# EAGLE design ALGO_dsPIC (EAGLE 4.16)
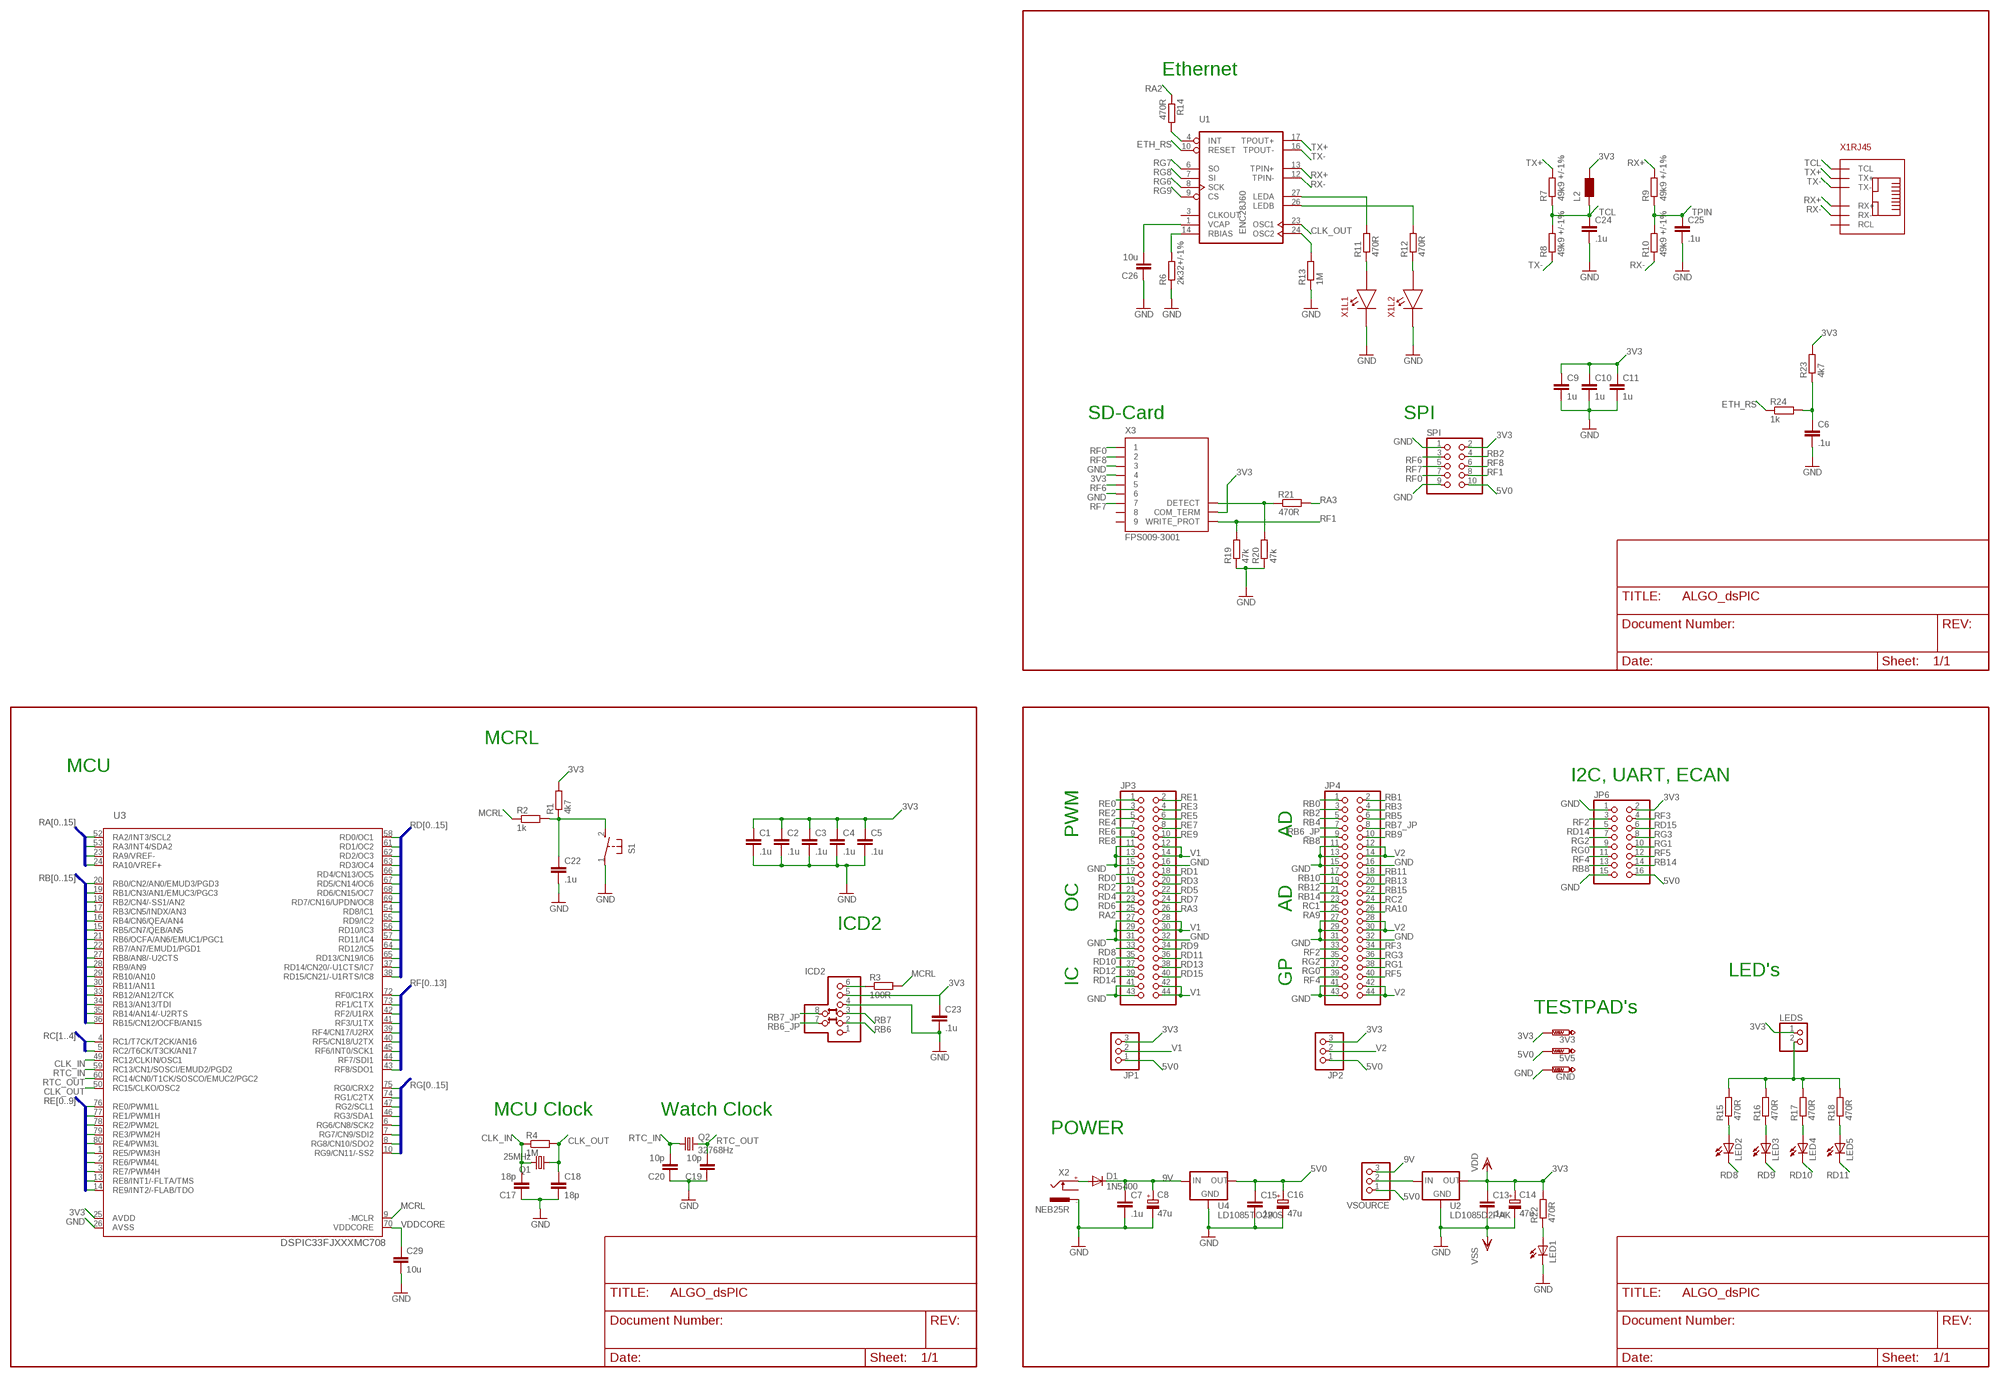
[diagram p0: schematic, sheet 1]

## Parts
3V3  PTR1PAD1-17  [P1-17]
5V5  PTR1PAD1-17  [P1-17]
C1  .1u  C-EUC0805  [C0805]
C2  .1u  C-EUC0805  [C0805]
C3  .1u  C-EUC0805  [C0805]
C4  .1u  C-EUC0805  [C0805]
C5  .1u  C-EUC0805  [C0805]
C6  .1u  C-EUC0805  [C0805]
C7  .1u  C-EUC0805  [C0805]
C8  47u  CPOL-EUE  [PANASONIC_E]
C9  1u  C-EUC0805  [C0805]
C10  1u  C-EUC0805  [C0805]
C11  1u  C-EUC0805  [C0805]
C13  .1u  C-EUC0805  [C0805]
C14  47u  CPOL-EUE  [PANASONIC_E]
C15  .1u  C-EUC0805  [C0805]
C16  47u  CPOL-EUE  [PANASONIC_E]
C17  18p  C-EUC0805  [C0805]
C18  18p  C-EUC0805  [C0805]
C19  10p  C-EUC0805  [C0805]
C20  10p  C-EUC0805  [C0805]
C22  .1u  C-EUC0805  [C0805]
C23  .1u  C-EUC0805  [C0805]
C24  .1u  C-EUC0805  [C0805]
C25  .1u  C-EUC0805  [C0805]
C26  10u  C-EUC0805  [C0805]
C29  10u  C-EUC0805  [C0805]
D1  1N5400  [DO201-15]
GND  PTR1PAD1-17  [P1-17]
ICD2  ICD2  [ICD2_JP]
JP1  PINHD-1X3  [1X03]
JP2  PINHD-1X3  [1X03]
JP3  PINHD-2X22  [2X22]
JP4  PINHD-2X22  [2X22]
JP6  PINHD-2X8  [2X08]
L2  WE-CBF_1210  [1210]
LED1  LEDSMT1206  [1206]
LED2  LEDSMT1206  [1206]
LED3  LEDSMT1206  [1206]
LED4  LEDSMT1206  [1206]
LED5  LEDSMT1206  [1206]
LEDS  PINHD-1X2  [1X02]
Q1  25MHz  CRYSTALHC49UP  [HC49UP]
Q2  32768Hz  CRYSTALTC26V  [TC26V]
R1  4k7  R-EU_M0805  [M0805]
R2  1k  R-EU_M0805  [M0805]
R3  100R  R-EU_M0805  [M0805]
R4  1M  R-EU_M0805  [M0805]
R6  2k32+/-1%  R-EU_M1206  [M1206]
R7  49k9 +/-1%  R-EU_M0805  [M0805]
R8  49k9 +/-1%  R-EU_M0805  [M0805]
R9  49k9 +/-1%  R-EU_M0805  [M0805]
R10  49k9 +/-1%  R-EU_M0805  [M0805]
R11  470R  R-EU_M0805  [M0805]
R12  470R  R-EU_M0805  [M0805]
R13  1M  R-EU_M0805  [M0805]
R14  470R  R-EU_M0805  [M0805]
R15  470R  R-EU_M0805  [M0805]
R16  470R  R-EU_M0805  [M0805]
R17  470R  R-EU_M0805  [M0805]
R18  470R  R-EU_M0805  [M0805]
R19  47k  R-EU_M0805  [M0805]
R20  47k  R-EU_M0805  [M0805]
R21  470R  R-EU_M0805  [M0805]
R22  470R  R-EU_M0805  [M0805]
R23  4k7  R-EU_M0805  [M0805]
R24  1k  R-EU_M0805  [M0805]
S1  31-XX  [B3F-31XX]
SPI  PINHD-2X5  [2X05]
U1  ENC28J60  [SSOP28]
U2  LD1085D2PAK  [D2PAK]
U3  DSPIC33FJXXXMC708  [TQFP80-12X12]
U4  LD1085TO220S  [TO220S]
VSOURCE  PINHD-1X3  [1X03]
X1  AMPHENOL_RJ45JACK  [AMPHENOL_RJ45]
X2  NEB25R  [NEB25R]
X3  FPS009-3001  [FPS009-3000]

## Nets
3V3 [3v3]: 3V3.1(TP) C1.1 C2.1 C3.1 C4.1 C5.1 C9.1 C10.1 C11.1 C13.1 C14.+ C23.1 ICD2.5 JP1.3 JP2.3 JP6.2 L2.2 LEDS.1 R1.2 R22.2 R23.2 SPI.2 U2.2(OUT) U3.25(AVDD) X3.4 X3.COM_TERM ; supply symbol labelled VDD
5V0 [pwr]: 5V5.1(TP) C15.1 C16.+ JP1.1 JP2.1 JP6.16 SPI.10 U4.2(OUT) VSOURCE.1
9V [pwr]: C7.1 C8.+ D1.C U4.3(IN) VSOURCE.3
CLK_IN [clk]: C17.2 Q1.2 R4.1 U3.49(RC12/CLKIN/OSC1)
CLK_OUT [clk]: C18.1 Q1.1 R4.2 U1.23(OSC1) U3.50(RC15/CLKO/OSC2)
ETH_RS [d_signal]: R24.1 U1.10(RESET)
GND [pwr]: C1.2 C2.2 C3.2 C4.2 C5.2 C6.2 C7.2 C8.- C9.2 C10.2 C11.2 C13.2 C14.- C15.2 C16.- C17.1 C18.2 C19.1 C20.1 C22.2 C23.2 C24.2 C25.2 C26.1 C29.2 GND.1(TP) ICD2.4 JP3.11 JP3.13 JP3.15 JP3.16 JP3.27 JP3.29 JP3.31 JP3.32 JP3.41 JP3.43 JP4.11 JP4.13 JP4.15 JP4.16 JP4.27 JP4.29 JP4.31 JP4.32 JP4.41 JP4.43 JP6.1 JP6.15 LED1.C R6.1 R13.1 R19.1 R20.1 S1.1(P) SPI.1 SPI.9 U2.1(GND) U3.26(AVSS) U4.1(GND) X1.P$7 X1.P$9 X2.- X3.3 X3.6 ; supply symbol labelled VSS
LEDA [a_signal]: R11.2 U1.27(LEDA)
LEDB [a_signal]: R12.2 U1.26(LEDB)
MCRL [d_signal]: R2.1 R3.2 U3.9(-MCLR)
N$1 [pwr]: U2.3(IN) VSOURCE.2
N$2 [pwr]: D1.A X2.+
N$3: LED2.A R15.1
N$4: LED3.A R16.1
N$5: LED4.A R17.1
N$6: LED1.A R22.1
N$7 [a_signal]: R12.1 X1.P$10
N$9 [d_signal]: C22.1 R1.1 R2.2 S1.2(S)
N$10 [d_signal]: ICD2.6 R3.1
N$11: R14.2 U1.4(INT)
N$12: LED5.A R18.1
N$13 [d_signal]: C6.1 R23.1 R24.2
N$14: R11.1 X1.P$8
N$19 [d_signal]: R20.2 R21.1 X3.DETECT
N$25: LEDS.2 R15.2 R16.2 R17.2 R18.2
OSC2 [clk]: R13.2 U1.24(OSC2)
RA2 [d_signal]: JP3.25 R14.1 U3.52(RA2/INT3/SCL2)
RA3 [d_signal]: JP3.26 R21.2 U3.53(RA3/INT4/SDA2)
RA9 [a_signal]: JP4.25 U3.23(RA9/VREF-)
RA10 [a_signal]: JP4.26 U3.24(RA10/VREF+)
RB0 [a_signal]: JP4.1 U3.20(RB0/CN2/AN0/EMUD3/PGD3)
RB1 [a_signal]: JP4.2 U3.19(RB1/CN3/AN1/EMUC3/PGC3)
RB2 [a_signal]: JP4.3 SPI.4 U3.18(RB2/CN4/-SS1/AN2)
RB3 [a_signal]: JP4.4 U3.17(RB3/CN5/INDX/AN3)
RB4 [a_signal]: JP4.5 U3.16(RB4/CN6/QEA/AN4)
RB5 [a_signal]: JP4.6 U3.15(RB5/CN7/QEB/AN5)
RB6 [a_signal]: ICD2.2 U3.21(RB6/OCFA/AN6/EMUC1/PGC1)
RB6_JP [d_signal]: ICD2.7 JP4.7
RB7 [a_signal]: ICD2.3 U3.22(RB7/AN7/EMUD1/PGD1)
RB7_JP [d_signal]: ICD2.8 JP4.8
RB8 [a_signal]: JP4.9 JP6.13 U3.27(RB8/AN8/-U2CTS)
RB9 [a_signal]: JP4.10 U3.28(RB9/AN9)
RB10 [a_signal]: JP4.17 U3.29(RB10/AN10)
RB11 [a_signal]: JP4.18 U3.30(RB11/AN11)
RB12 [a_signal]: JP4.19 U3.33(RB12/AN12/TCK)
RB13 [a_signal]: JP4.20 U3.34(RB13/AN13/TDI)
RB14 [a_signal]: JP4.21 JP6.14 U3.35(RB14/AN14/-U2RTS)
RB15 [a_signal]: JP4.22 U3.36(RB15/CN12/OCFB/AN15)
RBIAS [a_signal]: R6.2 U1.14(RBIAS)
RC1 [a_signal]: JP4.23 U3.4(RC1/T7CK/T2CK/AN16)
RC2 [a_signal]: JP4.24 U3.5(RC2/T6CK/T3CK/AN17)
RD0 [d_signal]: JP3.17 U3.58(RD0/OC1)
RD1 [d_signal]: JP3.18 U3.61(RD1/OC2)
RD2 [d_signal]: JP3.19 U3.62(RD2/OC3)
RD3 [d_signal]: JP3.20 U3.63(RD3/OC4)
RD4 [d_signal]: JP3.21 U3.66(RD4/CN13/OC5)
RD5 [d_signal]: JP3.22 U3.67(RD5/CN14/OC6)
RD6 [d_signal]: JP3.23 U3.68(RD6/CN15/OC7)
RD7 [d_signal]: JP3.24 U3.69(RD7/CN16/UPDN/OC8)
RD8 [d_signal]: JP3.33 LED2.C U3.54(RD8/IC1)
RD9 [d_signal]: JP3.34 LED3.C U3.55(RD9/IC2)
RD10 [d_signal]: JP3.35 LED4.C U3.56(RD10/IC3)
RD11 [d_signal]: JP3.36 LED5.C U3.57(RD11/IC4)
RD12 [d_signal]: JP3.37 U3.64(RD12/IC5)
RD13 [d_signal]: JP3.38 U3.65(RD13/CN19/IC6)
RD14 [d_signal]: JP3.39 JP6.5 U3.37(RD14/CN20/-U1CTS/IC7)
RD15 [d_signal]: JP3.40 JP6.6 U3.38(RD15/CN21/-U1RTS/IC8)
RE0 [d_signal]: JP3.1 U3.76(RE0/PWM1L)
RE1 [d_signal]: JP3.2 U3.77(RE1/PWM1H)
RE2 [d_signal]: JP3.3 U3.78(RE2/PWM2L)
RE3 [d_signal]: JP3.4 U3.79(RE3/PWM2H)
RE4 [d_signal]: JP3.5 U3.80(RE4/PWM3L)
RE5 [d_signal]: JP3.6 U3.1(RE5/PWM3H)
RE6 [d_signal]: JP3.7 U3.2(RE6/PWM4L)
RE7 [d_signal]: JP3.8 U3.3(RE7/PWM4H)
RE8 [d_signal]: JP3.9 U3.13(RE8/INT1/-FLTA/TMS)
RE9: JP3.10 U3.14(RE9/INT2/-FLAB/TDO)
RF0 [d_signal]: SPI.7 U3.72(RF0/C1RX) X3.1
RF1 [d_signal]: R19.2 SPI.8 U3.73(RF1/C1TX) X3.WRITE_PROT
RF2 [d_signal]: JP4.33 JP6.3 U3.42(RF2/U1RX)
RF3 [d_signal]: JP4.34 JP6.4 U3.41(RF3/U1TX)
RF4 [d_signal]: JP4.39 JP6.11 U3.39(RF4/CN17/U2RX)
RF5 [d_signal]: JP4.40 JP6.12 U3.40(RF5/CN18/U2TX)
RF6 [d_signal]: SPI.3 U3.45(RF6/INT0/SCK1) X3.5
RF7 [d_signal]: SPI.5 U3.44(RF7/SDI1) X3.7
RF8 [d_signal]: SPI.6 U3.43(RF8/SDO1) X3.2
RG0 [d_signal]: JP4.37 JP6.9 U3.75(RG0/CRX2)
RG1 [d_signal]: JP4.38 JP6.10 U3.74(RG1/C2TX)
RG2 [d_signal]: JP4.35 JP6.7 U3.47(RG2/SCL1)
RG3 [d_signal]: JP4.36 JP6.8 U3.46(RG3/SDA1)
RG6 [d_signal]: U1.8(SCK) U3.6(RG6/CN8/SCK2)
RG7 [d_signal]: U1.6(SO) U3.7(RG7/CN9/SDI2)
RG8 [d_signal]: U1.7(SI) U3.8(RG8/CN10/SDO2)
RG9 [d_signal]: U1.9(CS) U3.10(RG9/CN11/-SS2)
RTC_IN [clk]: C20.2 Q2.1 U3.59(RC13/CN1/SOSCI/EMUD2/PGD2)
RTC_OUT [clk]: C19.2 Q2.2 U3.60(RC14/CN0/T1CK/SOSCO/EMUC2/PGC2)
RX+ [a_signal]: R9.2 U1.13(TPIN+) X1.P$4(RJ45:RX+)
RX- [a_signal]: R10.1 U1.12(TPIN-) X1.P$5(RJ45:RX-)
TCL [a_signal]: C24.1 L2.1 R7.1 R8.2 X1.P$1(RJ45:TCL)
TPIN [a_signal]: C25.1 R9.1 R10.2
TX+ [a_signal]: R7.2 U1.17(TPOUT+) X1.P$2(RJ45:TX+)
TX- [a_signal]: R8.1 U1.16(TPOUT-) X1.P$3(RJ45:TX-)
V1 [pwr]: JP1.2 JP3.12 JP3.14 JP3.28 JP3.30 JP3.42 JP3.44
V2 [pwr]: JP2.2 JP4.12 JP4.14 JP4.28 JP4.30 JP4.42 JP4.44
VCAB [a_signal]: C26.2 U1.1(VCAP)
VDDCORE [3v3]: C29.1 U3.70(VDDCORE)
Unconnected: ICD2.1 U1.3(CLKOUT) U1.5(NC) X1.P$6(RJ45:RCL) X2.C X3.8 X3.9

## Buses
RB[0..15]
RA[0..15]
RC[1..4]
RE[0..9]
RD[0..15]
RF[0..13]
RG[0..15]

## Notes on the sheet
- Ethernet
- SD-Card | SPI
- MCRL
- MCU
- I2C, UART, ECAN
- PWM | AD
- OC | AD
- ICD2
- LED's
- IC | GP
- TESTPAD's
- MCU Clock | Watch Clock
- POWER

## Power pins joined to a net without a drawn wire
3V3: U1.15(VDD) U1.19(VDD) U1.20(VDD) U1.25(VDD) U1.28(VDD) U3.12(VDD) U3.32(VDD) U3.48(VDD) U3.71(VDD)
GND: U1.2(VSS) U1.11(VSS) U1.18(VSS) U1.21(VSS) U1.22(VSS) U3.11(VSS) U3.31(VSS) U3.51(VSS) X1.P$11(GND:GND) X1.P$12(GND@1:GND)

## Library data of the parts
3V3 5V5 GND = testpad:PTR1: TEST PIN
C1-C7 C9-C11 C13 C15 C17-C20 C22-C26 C29 = rcl:C-EU: CAPACITOR, European symbol
C8 C14 C16 = rcl:CPOL-EU: POLARIZED CAPACITOR, European symbol
D1 = diode:1N5400: DIODE standard rectifier, 3 A, 50 V (Motorola)
ICD2 = eigene:ICD2
JP1 JP2 VSOURCE = pinhead:PINHD-1X3: PIN HEADER
JP3 JP4 = pinhead:PINHD-2X22: PIN HEADER
JP6 = pinhead:PINHD-2X8: PIN HEADER
L2 = wuerth-elektronik:WE-CBF: SMD EMI Suppression Ferrite Beads - excellent anti-EMI properties - low DCR - impedances till 3000 ohms - rated current up to 6 A
LED1-LED5 = led:LED: LED OSRAM: - CHIPLED LG R971, LG N971, LY N971, LG Q971, LY Q971, LO R971, LY R971 LH N974, LH R974 LS Q976, LO Q976, LY Q976 LO Q996 - Hyper CHIPLED LW Q18S LB Q993, LB Q99A, LB R99A - SideLED LS A670, LO A670, LY A670, LG A670, LP A670 LB A673, LV A673, LT A673, LW A673 LH A674 LY A675 LS A676, LA A676, LO A676, LY A676, LW A676 LS A679, LY A679, LG A679 - Hyper Micro SIDELED® LS Y876, LA Y876, LO Y876, LY Y876 LT Y87S - SmartLED LW L88C, LW L88S LB L89C, LB L89S, LG L890 LS L89K, LO L89K, LY L89K LS L896, LA L896, LO L896, LY L896 - TOPLED LS T670, LO T670, LY T670, LG T670, LP T670 LSG T670, LSP T670, LSY T670, LOP T670, LYG T670 LG T671, LOG T671, LSG T671 LB T673, LV T673, LT T673, LW T673 LH T674 LS T676, LA T676, LO T676, LY T676, LB T676, LH T676, LSB T676, LW T676 LB T67C, LV T67C, LT T67C, LS T67K, LO T67K, LY T67K, LW E67C LS E67B, LA E67B, LO E67B, LY E67B, LB E67C, LV E67C, LT E67C LW T67C LS T679, LY T679, LG T679 LS T770, LO T770, LY T770, LG T770, LP T770 LB T773, LV T773, LT T773, LW T773 LH T774 LS E675, LA E675, LY E675, LS T675 LS T776, LA T776, LO T776, LY T776, LB T776 LHGB T686 LT T68C, LB T68C - Hyper Mini TOPLED® LB M676 - Mini TOPLED Santana® LG M470 LS M47K, LO M47K, LY M47K Source: http://www.osram.convergy.de - LUMILED® LXK2-PW12-R00, LXK2-PW12-S00, LXK2-PW14-U00, LXK2-PW14-V00 LXK2-PM12-R00, LXK2-PM12-S00, LXK2-PM14-U00 LXK2-PE12-Q00, LXK2-PE12-R00, LXK2-PE12-S00, LXK2-PE14-T00, LXK2-PE14-U00 LXK2-PB12-K00, LXK2-PB12-L00, LXK2-PB12-M00, LXK2-PB14-N00, LXK2-PB14-P00, LXK2-PB14-Q00 LXK2-PR12-L00, LXK2-PR12-M00, LXK2-PR14-Q00, LXK2-PR14-R00 LXK2-PD12-Q00, LXK2-PD12-R00, LXK2-PD12-S00 LXK2-PH12-R00, LXK2-PH12-S00 LXK2-PL12-P00, LXK2-PL12-Q00, LXK2-PL12-R00 Source: www.luxeon.com
LEDS = pinhead:PINHD-1X2: PIN HEADER
Q1 Q2 = crystal:CRYSTAL: CRYSTAL
R1-R4 R6-R24 = rcl:R-EU_: RESISTOR, European symbol
S1 = switch-omron:31-XX: OMRON SWITCH
SPI = pinhead:PINHD-2X5: PIN HEADER
U1 = eigene:ENC28J60
U2 U4 = v-reg-mich:LD1085
U3 = dspic33:DSPIC33FJXXXMC708
X1 = eigene:AMPHENOL_RJ45JACK
X2 = con-lumberg:NEB25R: Klinkeneinbaukupplung
X3 = con-yamaichi:FPS009-300*: SD Card and MMC Reader (Manual Insertion) Source: http://www.yamaichi.de/pdf/c_fps009_3000.pdf

## Net classes
0 default: width 0.254 mm
1 d_signal: width 0.254 mm
2 a_signal: width 0.254 mm
3 pwr: width 0.406 mm, clearance 0.305 mm
4 clk: width 0.254 mm, drill 0.203 mm
5 3v3: width 0.254 mm

## Board
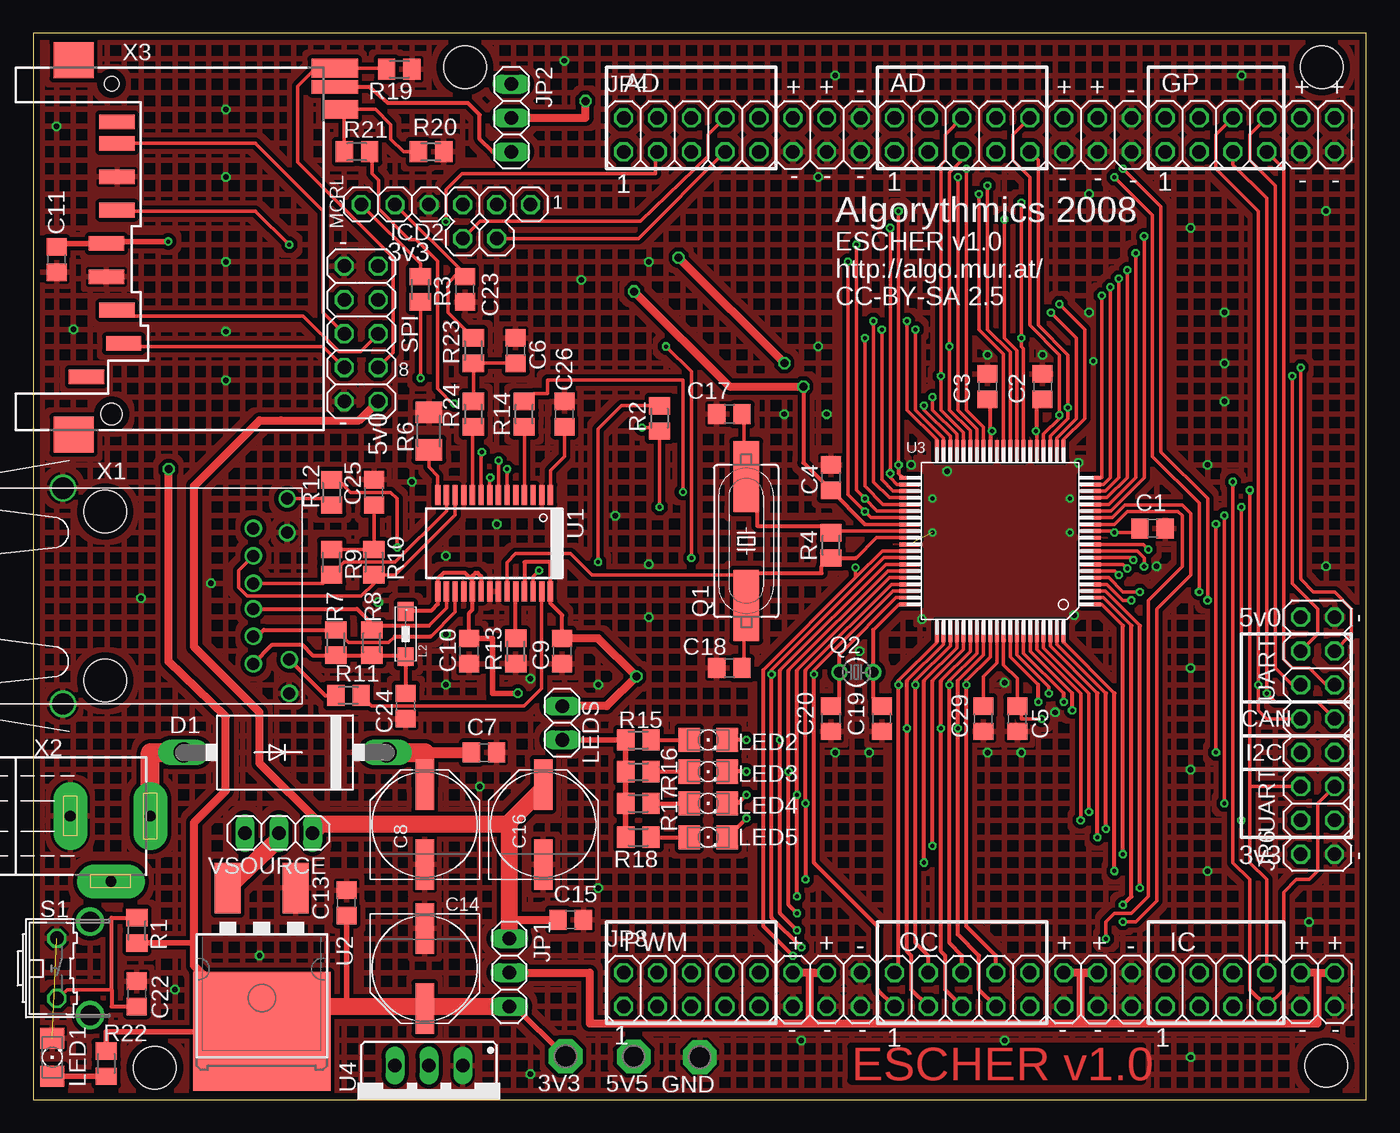
[diagram p1: board, top side]
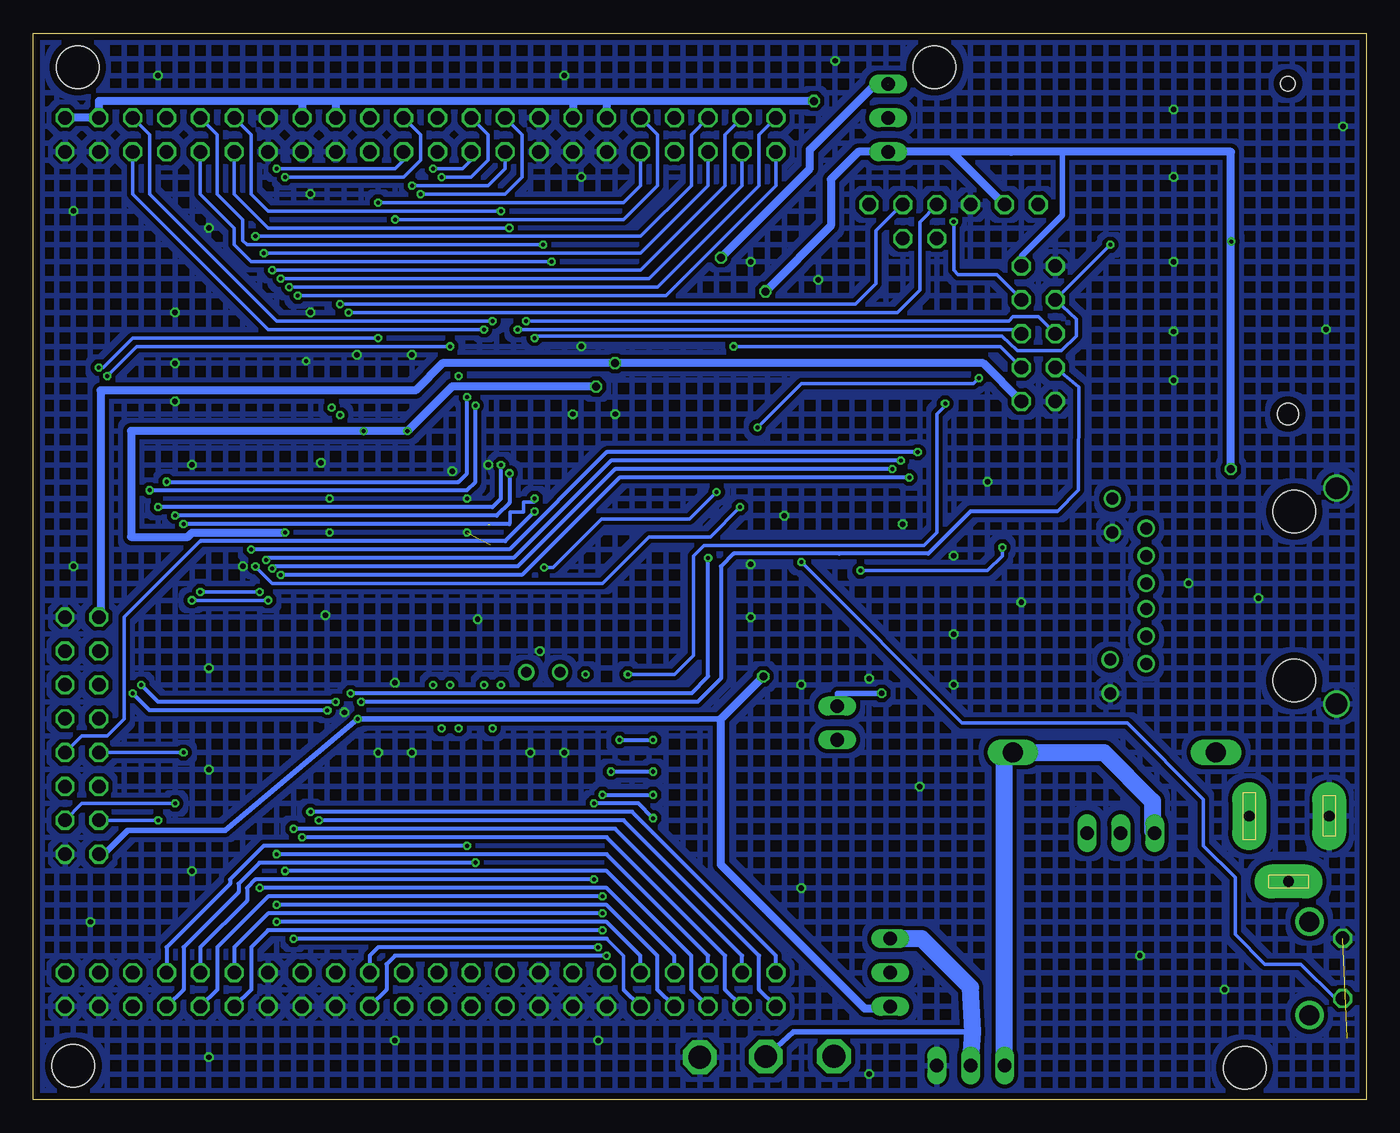
[diagram p2: board, bottom side, seen from below]

Size 100 x 80 mm. Coordinates in mm from the lower left corner, seen from the top.
Outline: 0,0 100,0 100,80 0,80 0,0
Copper layers (1*16): Top 0.035mm / dielectric 1.5mm / Bottom 0.035mm
Design rules "PCB-POOL": minimum track width 6mil, minimum drill 12mil, track to track 6mil, track to pad 6mil, pad to pad 6mil, via to via 6mil, smd to smd 6mil, copper to edge 20mil, drill to drill 8mil, minimum pad ring 8mil, minimum via ring 6mil, stop-mask expansion 3mil, vias tented up to drill 0mil, thermal gap 8mil
Holes 3.2 mm at 96.99,2.54 96.67,77.46 9.12,2.38 32.38,77.46

### Footprints (pad centres in the part's own frame; a part is rotated, then mirrored left to right if it is on the bottom)
P1-17 = drill 1.702 pad 2.54 octagon: 1 0,0
C0805 = smd 1.3 x 1.5: 1 -0.95,0; 2 0.95,0
PANASONIC_E = smd 3.8 x 1.4: + 3,0; - -3,0
DO201-15 = drill 1.499 long: A 7.62,0; C -7.62,0
ICD2_JP = drill 1.016 octagon: 1 -6.35,-1.27; 2 -3.81,-1.27; 3 -1.27,-1.27; 4 1.27,-1.27; 5 3.81,-1.27; 6 6.35,-1.27; 7 -3.81,1.27; 8 -1.27,1.27
1X03 = drill 1.016 long: 1 -2.54,0; 2 0,0; 3 2.54,0
2X22 = drill 1.016 octagon: 1 -25.4,-1.27; 2 -25.4,1.27; 3 -22.86,-1.27; 4 -22.86,1.27; 5 -20.32,-1.27; 6 -20.32,1.27; 7 -17.78,-1.27; 8 -17.78,1.27; 9 -15.24,-1.27; 10 -15.24,1.27; 11 -12.7,-1.27; 12 -12.7,1.27; 13 -10.16,-1.27; 14 -10.16,1.27; 15 -7.62,-1.27; 16 -7.62,1.27; 17 -5.08,-1.27; 18 -5.08,1.27; 19 -2.54,-1.27; 20 -2.54,1.27; 21 0,-1.27; 22 0,1.27; 23 2.54,-1.27; 24 2.54,1.27; 25 5.08,-1.27; 26 5.08,1.27; 27 7.62,-1.27; 28 7.62,1.27; 29 10.16,-1.27; 30 10.16,1.27; 31 12.7,-1.27; 32 12.7,1.27; 33 15.24,-1.27; 34 15.24,1.27; 35 17.78,-1.27; 36 17.78,1.27; 37 20.32,-1.27; 38 20.32,1.27; 39 22.86,-1.27; 40 22.86,1.27; 41 25.4,-1.27; 42 25.4,1.27; 43 27.94,-1.27; 44 27.94,1.27
2X08 = drill 1.016 octagon: 1 -8.89,-1.27; 2 -8.89,1.27; 3 -6.35,-1.27; 4 -6.35,1.27; 5 -3.81,-1.27; 6 -3.81,1.27; 7 -1.27,-1.27; 8 -1.27,1.27; 9 1.27,-1.27; 10 1.27,1.27; 11 3.81,-1.27; 12 3.81,1.27; 13 6.35,-1.27; 14 6.35,1.27; 15 8.89,-1.27; 16 8.89,1.27
1210 = smd 1.4 x 1.2: 1 -1.7,0; 2 1.7,0
1206 = smd 1.6 x 1.803: A -1.422,0; C 1.422,0
1X02 = drill 1.016 long: 1 -1.27,0; 2 1.27,0
HC49UP = smd 5.334 x 1.93: 1 -4.826,0; 2 4.826,0
TC26V = drill 0.813 round: 1 -1.27,0; 2 1.27,0
M0805 = smd 1.3 x 1.6: 1 -0.95,0; 2 0.95,0
M1206 = smd 1.6 x 2: 1 -1.4,0; 2 1.4,0
B3F-31XX = drill 1.016 octagon: 1 -2.261,-1.245; 2 2.261,-1.245 | drill 1.499 pad 2.159 round: 3 -3.505,1.245; 4 3.505,1.245
2X05 = drill 1.016 octagon: 1 -5.08,-1.27; 2 -5.08,1.27; 3 -2.54,-1.27; 4 -2.54,1.27; 5 0,-1.27; 6 0,1.27; 7 2.54,-1.27; 8 2.54,1.27; 9 5.08,-1.27; 10 5.08,1.27
SSOP28 = smd 0.4 x 1.5: 1 -0.542,-1.72; 2 0.108,-1.72; 3 0.758,-1.72; 4 1.408,-1.72; 5 2.058,-1.72; 6 2.708,-1.72; 7 3.358,-1.72; 8 4.008,-1.72; 9 4.658,-1.72; 10 5.308,-1.72; 11 5.958,-1.72; 12 6.608,-1.72; 13 7.258,-1.72; 14 7.908,-1.72; 15 7.908,5.53; 16 7.258,5.53; 17 6.608,5.53; 18 5.958,5.53; 19 5.308,5.53; 20 4.658,5.53; 21 4.008,5.53; 22 3.358,5.53; 23 2.708,5.53; 24 2.058,5.53; 25 1.408,5.53; 26 0.758,5.53; 27 0.108,5.53; 28 -0.542,5.53
D2PAK = smd 1.93 x 3.81: 1 -2.55,-8.25; 3 2.55,-8.25 | smd 10.3 x 8.9: 2 0,2.5
TQFP80-12X12 = smd 1.52 x 0.29: 1 -6.809,4.75; 2 -6.809,4.25; 3 -6.809,3.75; 4 -6.809,3.25; 5 -6.809,2.75; 6 -6.809,2.25; 7 -6.809,1.75; 8 -6.809,1.25; 9 -6.809,0.75; 10 -6.809,0.25; 11 -6.809,-0.25; 12 -6.809,-0.75; 13 -6.809,-1.25; 14 -6.809,-1.75; 15 -6.809,-2.25; 16 -6.809,-2.75; 17 -6.809,-3.25; 18 -6.809,-3.75; 19 -6.809,-4.25; 20 -6.809,-4.75; 41 6.809,-4.75; 42 6.809,-4.25; 43 6.809,-3.75; 44 6.809,-3.25; 45 6.809,-2.75; 46 6.809,-2.25; 47 6.809,-1.75; 48 6.809,-1.25; 49 6.809,-0.75; 50 6.809,-0.25; 51 6.809,0.25; 52 6.809,0.75; 53 6.809,1.25; 54 6.809,1.75; 55 6.809,2.25; 56 6.809,2.75; 57 6.809,3.25; 58 6.809,3.75; 59 6.809,4.25; 60 6.809,4.75 | smd 0.29 x 1.52: 21 -4.75,-6.809; 22 -4.25,-6.809; 23 -3.75,-6.809; 24 -3.25,-6.809; 25 -2.75,-6.809; 26 -2.25,-6.809; 27 -1.75,-6.809; 28 -1.25,-6.809; 29 -0.75,-6.809; 30 -0.25,-6.809; 31 0.25,-6.809; 32 0.75,-6.809; 33 1.25,-6.809; 34 1.75,-6.809; 35 2.25,-6.809; 36 2.75,-6.809; 37 3.25,-6.809; 38 3.75,-6.809; 39 4.25,-6.809; 40 4.75,-6.809; 61 4.75,6.809; 62 4.25,6.809; 63 3.75,6.809; 64 3.25,6.809; 65 2.75,6.809; 66 2.25,6.809; 67 1.75,6.809; 68 1.25,6.809; 69 0.75,6.809; 70 0.25,6.809; 71 -0.25,6.809; 72 -0.75,6.809; 73 -1.25,6.809; 74 -1.75,6.809; 75 -2.25,6.809; 76 -2.75,6.809; 77 -3.25,6.809; 78 -3.75,6.809; 79 -4.25,6.809; 80 -4.75,6.809
TO220S = drill 1.016 long: 1 -2.54,-2.54; 2 0,-2.54; 3 2.54,-2.54
AMPHENOL_RJ45 = drill 0.9 round: P$1 0,0; P$2 -2.064,0; P$3 -4.128,0; P$4 -6.032,0; P$5 -8.096,0; P$6 -10.16,0; P$7 2.223,2.699; P$8 -0.317,2.699; P$9 -9.842,2.54; P$10 -12.382,2.54 | drill 1.6 round: P$11 3.016,-14.287; P$12 -13.176,-14.287 | hole 3.2: -11.43,-11.113; 1.27,-11.113
NEB25R = drill 0.813 pad 2.54 long: + 0,7.35; - 0,1.35; C 4.9,4.4
FPS009-3000 = smd 2.65 x 1.1: 1 -0.915,-5.3; 2 -0.415,-7.8; 3 0.385,-10.3; 4 0.385,-12.8; 5 -0.415,-15.3; 6 -0.415,-17.8; 7 -0.415,-20.3; 8 -0.415,-21.925; 9 1.885,-2.8 | smd 3.5 x 1: COM_TERM -16.75,-24.55 | smd 2.5 x 1.4: DETECT -17.25,-22.85 | smd 3 x 2.7: M1 2.85,1.55; M2 2.85,-26.55 | smd 3.5 x 1.4: WRITE_PROT -16.75,-25.95 | hole 1.6: 0,0 | hole 1.1: 0,-24.8

### Placement (x,y rotation side)
3V3  39.93,3.25 180 top
5V5  45.05,3.22 180 top
C1  83.97,42.86 0 top
C2  75.72,53.49 90 top
C3  71.59,53.49 90 top
C4  59.84,46.67 90 top
C5  73.81,28.57 270 top
C6  36.19,56.19 90 top
C7  33.81,26.03 0 top
C8  29.36,20.63 90 top
C9  39.68,33.65 270 top
C10  32.7,33.65 270 top
C11  1.74,63.02 270 top
C13  23.49,14.76 90 top
C14  29.36,9.84 270 top
C15  40.32,13.49 0 top
C16  38.25,20.63 90 top
C17  52.22,51.43 0 top
C18  52.22,32.38 180 top
C19  63.65,28.57 90 top
C20  59.84,28.57 90 top
C22  7.77,7.93 90 top
C23  32.38,60.8 270 top
C24  27.93,29.52 270 top
C25  25.55,45.56 90 top
C26  39.84,51.43 270 top
C29  71.27,28.57 270 top
D1  18.88,26.03 180 top
GND  50,3.17 180 top
ICD2  30.95,65.88 180 top
JP1  35.71,9.52 270 top
JP2  35.87,73.66 270 top
JP3  69.69,8.25 0 top
JP4  69.69,72.38 0 top
JP6  96.36,27.3 90 top
L2  27.93,34.92 90 top
LED1  1.42,3.17 90 top
LED2  50.64,26.98 0 top
LED3  50.63,24.6 0 top
LED4  50.64,22.22 0 top
LED5  50.63,19.68 0 top
LEDS  39.68,28.25 270 top
Q1  53.49,41.91 90 top
Q2  61.75,32.06 0 top
R1  7.77,12.7 270 top
R2  46.98,51.11 90 top
R3  29.04,60.8 270 top
R4  59.84,41.59 270 top
R6  29.68,50.16 270 top
R7  22.7,34.29 90 top
R8  25.39,34.29 270 top
R9  22.38,40.32 270 top
R10  25.55,40.32 90 top
R11  23.65,30.32 0 top
R12  22.38,45.56 90 top
R13  36.19,33.65 90 top
R14  36.82,51.43 270 top
R15  45.4,26.98 180 top
R16  45.4,24.6 180 top
R17  45.4,22.22 180 top
R18  45.4,19.68 180 top
R19  27.46,77.31 180 top
R20  29.84,71.11 180 top
R21  24.28,71.11 0 top
R22  5.47,2.69 90 top
R23  33.01,56.19 90 top
R24  33.01,51.43 90 top
S1  3.01,9.84 270 top
SPI  24.6,57.46 270 top
U1  38.25,43.65 180 top
U2  17.14,7.62 180 top
U3  72.54,41.91 180 top
U4  29.68,-0.01 180 top
VSOURCE  18.41,20 180 top
X1  16.5,32.7 270 top
X2  1.42,21.27 270 top
X3  5.87,51.43 180 top

### Tracks (layer width: path | path; a pad name or v marks a point on that pad's centre or on a via)
3V3  (via drill 0.3, 0.41, 0.6)  (1 unrouted)
  Top 0.254: 62.4,43.16 65.89,43.16 | C1.1 82.82,42.66 | 75.24,50.16 75.29,50.16 | v71.94,50.16 71.79,50.16 | C1.1 | C1.1 82.7,42.54 v81.11,42.54 81,42.66 U3.12 | 72.79,34.41 72.79,32.61 73.81,31.59 C5.1 74.13,29.08 74.13,28.57 v75.65,28.57 | 72.79,34.41 U3.71 | U3.71 72.79,35.26 | v75.21,50.16 75.24,50.16 | U3.25 75.29,50.11 75.24,50.16 | 6.57,64.38 X3.4 | ICD2.5 32.35,61.97 C23.1 31.9,62.06 31.11,61.27 31.11,59.05 R23.2 | U3.32 71.84,48.89 71.79,48.89 | 72.79,34.41 72.86,34.41 U3.71 | 27.93,36.67 | 27.93,36.67 L2.2 | R23.2 | R23.2
  Top 0.305: C3.1 71.59,52.38 71.79,52.18 71.79,50.16 71.79,48.89 U3.32 71.79,48.55 | C2.1 75.72,52.38 75.29,51.96 75.29,50.16 | 27.93,36.67 29.84,36.67 30.34,37.17 U1.15 30.34,39.08 30.79,39.52 32.38,39.52 32.94,38.96 U1.19 | U1.19 32.94,36.76 32.7,36.51 C10.1 | U1.19 32.94,39.3 33.17,39.52 33.33,39.52 33.59,39.26 U1.20 | C9.1 | C9.1 | C9.1 39.68,36.35 38.79,37.24 U1.28 38.79,40.32 36.84,40.32 U1.25 | C4.1 | C4.1 57.78,47.78 v57.78,53.49 | C4.1 62.4,43.16 | X3.COM_TERM 22.64,75.96 25.25,75.96 26.6,74.77 32.62,74.77 33.49,73.89 33.49,72.07 34.44,71.11 JP2.3
  Top 0.406: C4.1 | 5.48,64.13 X3.4 2,64.23 C11.1 | U2.2 17.14,5.08 5.47,5.08 R22.2 | R1.2 12.06,11.74 | 23.49,13.97 C13.1 23.49,6.98 19.16,6.98 | v10.12,64.38 6.57,64.38 | C10.1 34.44,34.6 34.44,30.47 v36.35,30.47 | JP1.3 35.8,7.07 35.97,7.09 3V3.1
  Top 0.61: U2.2 12.06,10.04 12.06,11.74 12.06,20.79 14.44,23.17 14.44,28.73 10.15,32.86 v10.15,47.3 | C9.1 42.38,34.6 v45.24,31.74 43.02,29.52 LEDS.1 | v57.78,53.49 | v45.08,60.64 52.22,53.49 v57.78,53.49
  Top 1.27: C14.+ 29.36,6.82 | C14.+ 29.5,6.98 JP1.3 | C14.+ 29.36,6.98 19.16,6.98 U2.2
  Bottom 0.254: 71.91,50.16 71.84,50.16 | 10.15,64.38 v10.12,64.38 | 26.63,71.11 26.63,71.15
  Bottom 0.305: 22.81,71.11 23.96,71.27
  Bottom 0.406: 74.77,50.16 v75.21,50.16 | 95.4,18.41 JP6.2 94.7,18.41 92.93,20.19 85.62,20.19 v75.65,28.57 48.41,28.57 | SPI.2 25.87,63.29 22.81,66.35 22.81,71.11 | 71.91,50.16 v71.94,50.16 | v36.35,30.47 39.68,30.47 LEDS.1
  Bottom 0.61: v71.94,50.16 74.77,50.16 92.67,50.16 92.67,42.22 88.42,42.22 88.1,42.54 v81.11,42.54 | v45.24,31.74 48.41,28.57 48.41,17.62 37.62,6.82 35.87,6.82 JP1.3 | v10.15,47.3 10.15,64.38 10.15,71.11 22.81,71.11 26.63,71.11 30.95,71.11 | 30.95,71.11 30.95,70.92 ICD2.5 | v57.78,53.49 68.57,53.49 71.91,50.16 | 30.95,71.11 JP2.3 38.09,71.11 40.16,69.05 40.16,65.56 v45.08,60.64
5V0  (via drill 0.6)  (1 unrouted)
  Top 0.61: 21.58,20.63 16.98,25.24 16.98,29.05 12.06,33.97 12.06,46.03 16.66,50.64 16.98,50.95 18.57,50.95 24.44,50.95 SPI.10 | v56.35,55.24 v48.41,63.18 | 35.71,13.49 C15.1
  Top 1.27: VSOURCE.1 21.58,20.63 35.55,20.63 | 35.55,20.63 38.25,23.33 C16.+ | 35.55,20.63 35.71,20.47 35.71,13.49 JP1.1
  Bottom 0.406: 5V5.1 42.95,5.09 29.52,5.09
  Bottom 0.61: JP6.16 94.96,36.7 94.96,53.21 71.34,53.21 69.3,55.24 v56.35,55.24 28.73,55.24 SPI.10 | v48.41,63.18 41.74,69.84 41.74,71.27 36.82,76.19 36.98,76.19 JP2.1
  Bottom 1.27: U4.2 29.52,5.09 29.68,8.41 33.33,12.06 JP1.1 35.87,12.06
9V
  Top 0.813: 29.2,26.03 C7.1
  Top 1.422: C8.+ 29.36,26.03 29.2,26.03 D1.C
  Bottom 1.27: U4.3 27.14,25.39 D1.C 19.68,26.03 16.03,22.38 16.03,20.16 VSOURCE.3
CLK_IN
  Top 0.254: C17.2 53.3,50.92 53.3,49.14 Q1.2 54.32,44.32 | 59.14,43.05 R4.1 | 59.96,42.66 U3.49
  Top 0.305: R4.1 59.96,42.66 | 59.14,43.05 54.32,43.05 54.32,44.32
CLK_OUT
  Top 0.254: C18.1 53.3,32.89 53.3,34.67 Q1.1 54.28,39.37 | 59.14,41.02 R4.2 59.14,40 | 54.28,39.37 54.32,39.49 | U3.50 63.27,42.16 61.75,40.64 | U1.23 35.54,40.31 36.19,40.95 40.32,40.95 41.9,39.37 54.29,39.37 54.28,39.37
  Top 0.305: R4.2 61.75,40.64 | 54.32,39.49 59.14,39.49 59.14,40
  Top 0.406: Q1.1 53.49,37.14
ETH_RS
  Top 0.254: 33.01,50.32 | 33.01,50.32 R24.1 | U1.10 32.94,50.25 33.01,50.32
GND  (via drill 0.3, 0.41)  (2 unrouted)
  other vias: 1.74,73.02 3.01,57.78 14.44,62.86 14.44,69.21 14.44,74.29 14.44,57.62 14.44,53.97 8.09,37.62 13.33,38.73 16.98,10.79 37.3,1.9 42.38,15.87 46.19,36.19 46.19,40.16 43.65,43.81 34.76,43.17 30.95,40.79 28.41,46.35 56.35,51.43 59.52,51.43 58.89,56.51 46.19,62.86 41.11,61.51 58.89,69.21 68.57,47.14 78.42,47.78 77.78,45.08 67.46,45.08 67.46,42.54 77.78,42.54 78.1,36.35 66.67,36.03 72.86,31.27 71.59,26.03 74.13,26.03 76.67,29.05 71.59,55.88 75.72,55.87 79.53,55.4 79.21,59.05 79.21,67.94 86.83,65.4 89.37,59.05 89.37,55.24 89.37,52.38 88.1,47.62 96.99,66.67 96.99,40 90.64,76.83 60.16,76.83 39.84,77.94 57.62,4.44 72.86,4.44 86.83,3.17 88.1,17.14 86.83,24.76 86.83,32.38 62.7,26.03 60.16,26.03 95.72,13.33 33.49,23.49 84.29,40 25.87,37.3 30.95,34.92 30.95,31.11 42.38,31.11 37.3,31.59 10.63,8.25 65.88,47.62 61.99,33.65
  pour Top: 66.19,48.26 78.89,48.26 78.89,36.51 77.94,35.55 66.19,35.55
  pour Bottom (isolate 0.254, hatched): -0.17,80 99.85,80 99.85,-0.01 -0.17,-0.01
  pour Top (isolate 0.152, rank 2, hatched): -0.01,80 100.16,80 100.16,-0.01 -0.01,-0.01
LEDA
  Top 0.254: R11.2 25.39,29.52 36.82,29.52 38.14,30.84 U1.27
LEDB  (via drill 0.3)
  Top 0.254: R12.2 22.86,46.51 23.81,45.56 26.82,45.56 27.3,45.08 v27.3,41.43 | U1.26 37.49,39.24 v37.94,39.68
  Bottom 0.254: 28.41,39.68 v37.94,39.68 | 28.41,39.68 | 28.41,39.68 27.3,40.79 v27.3,41.43
MCRL  (via drill 0.3)
  Top 0.254: v83.34,40 83.34,40.64 82.82,41.16 U3.9 | R2.1 | R2.1 46.19,50.41 v45.68,50.41 | R2.1 v46.98,44.45 | v29.04,54.13 R3.2
  Bottom 0.254: v83.34,40 82.07,38.73 57.3,38.73 53.81,42.22 49.21,42.22 v46.98,44.45 | v45.68,50.41 42.38,53.72 29.46,53.72 v29.04,54.13
N$1
  Top 1.27: VSOURCE.2 | VSOURCE.2 18.41,20.16 | VSOURCE.2 | U2.3 18.41,19.53 VSOURCE.2
N$2
  Top 1.422: X2.+ 8.77,26.03 D1.A
N$3
  Top 0.305: LED2.A 49.37,26.98 R15.1
N$4
  Top 0.305: 49.37,24.6 | 49.37,24.6 LED3.A | R16.1 49.37,24.6
N$5
  Top 0.305: R17.1 LED4.A
N$6
  Top 0.406: 6.03,1.74 | 6.03,1.74 R22.1 | LED1.A 6.03,1.74
N$7
  Top 0.254: R12.1 21.9,45.08 X1.P$10
N$9  (via drill 0.3)
  Top 0.254: R2.2 44.12,52.06 42.38,50.32 v42.38,40.32 | S1.2 1.74,7.52 2.53,8.25 5.87,8.25
  Top 0.305: C22.1 5.87,6.98 5.87,8.25 5.87,13.65 R1.1
  Bottom 0.254: S1.2 2.34,7.58 4.92,10.16 7.61,10.16 9.84,12.38 9.84,16.66 12.22,19.04 12.22,22.54 17.93,28.25 30.31,28.25 v42.38,40.32
N$10
  Top 0.254: ICD2.6 29.04,62.7 R3.1
N$11
  Top 0.254: R14.2 36.82,50 36.84,49.98 U1.4
N$12
  Top 0.305: LED5.A | R18.1 LED5.A | LED5.A
N$13
  Top 0.254: R24.2 R23.1 | R23.1 33.01,55.4 | 33.01,55.4 | C6.1 | C6.1 | R23.1 C6.1
N$14
  Top 0.305: X1.P$8 21.9,30.32 R11.1
N$19
  Top 0.254: 23.33,73.78 23.33,71.75 R21.1 | 23.33,73.78 X3.DETECT 23.02,74.28 23.01,74.29 25.69,74.29 26.82,73.15 26.82,72.07 27.77,71.11 R20.2 | 23.33,73.78 23.33,74.13
N$25
  Top 0.406: LEDS.2 R15.2 R16.2 | R16.2 44.45,24.45 44.44,24.44 | R16.2 R17.2 R18.2 | R18.2 | R18.2
OSC2
  Top 0.305: R13.2 U1.24
RA2  (via drill 0.3)
  Top 0.254: U3.52 63.7,41.16 61.73,39.19 | 54.76,32.22 61.73,39.19 | v48.73,45.59 48.73,53.97 38.57,53.97 38.57,52.95 37.55,52.95 R14.1 | v61.68,39.92 61.68,39.24 61.73,39.19
  Top 0.305: v56.98,10.79 54.76,13.01 54.76,32.22
  Bottom 0.254: v48.73,45.59 50.76,43.56 57.37,43.56 61,39.92 v61.68,39.92
  Bottom 0.305: JP3.25 73.5,8.25 73.5,10.16 72.86,10.79 v56.98,10.79
RA3  (via drill 0.3)
  Top 0.254: U3.53 63.83,40.66 55.4,32.22 | 25.36,70.48 R21.2 25.25,71.11 25.4,70.96 25.4,69.48 25.89,68.98 25.89,66.83 28.21,64.52 28.7,64.52 30.31,62.91 30.31,53.34 31.58,52.07 v31.58,52.22
  Top 0.305: v57.62,11.43 55.4,13.65 v55.4,31.9 55.4,32.22
  Bottom 0.254: v55.4,31.9 51.91,31.9 50.48,33.33 50.48,40.79 49.68,41.59 33.17,41.59 32.22,42.54 32.22,51.43 31.58,52.07 v31.58,52.22
  Bottom 0.305: JP3.26 74.77,10.79 74.13,11.43 v57.62,11.43
RA9  (via drill 0.3)
  Top 0.254: JP4.25 75.4,70.48 75.4,58.1 77.62,55.88 v77.62,51.91 77.62,51.11 76.29,49.78 U3.23
RA10  (via drill 0.3)
  Top 0.254: JP4.26 73.5,72.38 73.5,70.48 74.77,69.21 74.77,58.1 76.99,55.88 v76.99,51.35 76.99,51.11 75.79,49.92 U3.24
RB0  (via drill 0.3)
  Top 0.254: v80.16,60.32 80.16,46.67 80.15,46.66 U3.20
  Bottom 0.254: JP4.1 44.28,68.57 52.54,60.32 v80.16,60.32
RB1  (via drill 0.3)
  Top 0.254: v80.8,60.96 80.8,46.67 80.28,46.16 U3.19
  Bottom 0.254: JP4.2 45.55,72.38 45.55,68.57 53.17,60.96 v80.8,60.96
RB2  (via drill 0.3)
  Top 0.254: v81.43,61.59 81.43,46.67 80.42,45.66 U3.18 | JP4.3 46.7,70.48 46.7,69.46 32.16,69.46 30.95,68.26 v30.95,65.88
  Bottom 0.254: JP4.3 46.82,68.57 53.81,61.59 v81.43,61.59 | SPI.4 25.74,59.94 27.71,61.91 30.63,61.91 30.95,62.23 v30.95,65.88
RB3  (via drill 0.3)
  Top 0.254: v82.07,62.23 82.07,46.67 80.55,45.16 U3.17
  Bottom 0.254: JP4.4 48.09,72.38 48.09,68.57 54.45,62.23 v82.07,62.23
RB4  (via drill 0.3)
  Top 0.254: v82.7,63.5 82.7,46.67 80.69,44.66 U3.16
  Bottom 0.254: JP4.5 49.37,68.57 54.45,63.5 v82.7,63.5
RB5  (via drill 0.3)
  Top 0.254: v83.34,64.77 83.34,46.67 80.83,44.16 U3.15
  Bottom 0.254: JP4.6 50.63,72.38 50.63,68.57 54.45,64.77 v83.34,64.77
RB6  (via drill 0.3)
  Top 0.254: U3.21 77.29,49.51 78.89,51.11 78.89,57.78 v76.99,59.69
  Bottom 0.254: v76.99,59.69 38.33,59.69 36.79,61.22 36.79,65.18 34.81,67.16 34.79,67.15 ICD2.2
RB6_JP
  Top 0.254: ICD2.7 45.4,64.61 JP4.7
RB7  (via drill 0.3)
  Top 0.254: U3.22 76.79,49.65 78.26,51.11 78.26,57.15 v76.35,59.05
  Bottom 0.254: v76.35,59.05 35.17,59.05 33.49,60.73 33.49,65.84 32.19,67.15 | 32.19,67.15 32.17,67.16 | 32.19,67.15 ICD2.3
RB7_JP
  Top 0.254: ICD2.8 | ICD2.8 33.5,65.89 45.56,65.89 50.63,70.8 50.63,72.38 JP4.8
RB8  (via drill 0.3)
  Top 0.254: v74.13,67.3 v74.13,57.15 74.13,56.51 74.29,56.35 U3.27 | JP6.13 98.89,34.92 98.89,36.83 97.62,38.1 96.04,38.1 95.08,39.05 v95.08,54.92
  Bottom 0.254: JP4.9 54.45,68.57 55.71,67.3 v74.13,67.3 | v74.13,57.15 92.55,57.15 94.77,54.92 v95.08,54.92
RB9  (via drill 0.3)
  Top 0.254: v72.86,66.03 72.86,57.15 73.79,56.21 U3.28
  Bottom 0.254: JP4.10 53.17,72.38 53.17,68.57 55.71,66.03 v72.86,66.03
RB10  (via drill 0.3)
  Top 0.254: v71.59,68.57 71.59,57.78 73.29,56.08 U3.29
  Bottom 0.254: JP4.17 64.61,69.84 65.88,68.57 v71.59,68.57
RB11  (via drill 0.3)
  Top 0.254: v70.95,67.94 70.95,57.78 72.79,55.94 U3.30
  Bottom 0.254: JP4.18 63.34,72.38 63.34,69.21 64.61,67.94 v70.95,67.94
RB12  (via drill 0.3)
  Top 0.254: v70,69.84 70,51.75 71.29,50.46 U3.33
  Bottom 0.254: JP4.19 67.14,70.48 67.78,69.84 v70,69.84
RB13  (via drill 0.3)
  Top 0.254: v69.37,69.21 69.37,51.75 70.79,50.32 U3.34
  Bottom 0.254: JP4.20 65.88,72.38 65.88,70.48 67.14,69.21 v69.37,69.21
RB14  (via drill 0.3)
  Top 0.254: JP4.21 69.69,70.48 68.73,69.53 v68.73,56.51 68.73,51.75 70.29,50.19 U3.35 | JP6.14 96.36,34.92 96.36,36.83 94.45,38.73 v94.45,54.29
  Bottom 0.254: v68.73,56.51 92.23,56.51 v94.45,54.29
RB15  (via drill 0.3)
  Top 0.254: JP4.22 68.41,72.38 68.41,70.48 68.1,70.16 v68.1,54.29 68.1,51.75 69.79,50.05 U3.36
RBIAS
  Top 0.254: U1.14 30.34,46.8 29.68,47.46 29.68,48.89 | 29.68,48.89 | 29.68,48.89 R6.2
RC1  (via drill 0.3)
  Top 0.254: v81.75,69.84 84.61,66.99 84.61,48.57 88.1,45.08 v88.1,37.46 | U3.4 80.55,38.66 81.75,37.46 v82.39,37.46
  Bottom 0.254: v81.75,69.84 72.86,69.84 72.22,70.48 JP4.23 | v82.39,37.46 v88.1,37.46
RC2  (via drill 0.3)
  Top 0.254: v81.11,69.21 83.97,66.35 83.97,48.26 87.47,44.76 v87.47,38.1 | U3.5 80.69,39.16 81.75,38.1 v83.02,38.1
  Bottom 0.254: JP4.24 70.95,72.38 70.95,70.48 72.22,69.21 v81.11,69.21 | v83.02,38.1 v87.47,38.1
RD0  (via drill 0.3)
  Top 0.254: U3.58 64.51,38.16 58.57,32.22
  Top 0.305: JP3.17 63.34,8.25 63.34,13.01 58.57,17.77 v58.57,31.9 58.57,32.22
RD1  (via drill 0.3)
  Top 0.254: U3.61 67.79,34.3 64.92,31.43
  Top 0.305: JP3.18 64.92,9.84 v64.92,31.11 64.92,31.43
RD2  (via drill 0.3)
  Top 0.254: U3.62 68.29,34.16 65.56,31.43
  Top 0.305: JP3.19 65.88,8.25 65.88,10.79 65.56,11.11 v65.56,27.86 65.56,31.43
RD3  (via drill 0.3)
  Top 0.254: U3.63 68.79,34.03 66.19,31.43
  Top 0.305: JP3.20 67.14,10.79 66.19,11.74 v66.19,31.11 66.19,31.43
RD4  (via drill 0.3)
  Top 0.254: U3.66 70.29,33.62 68.1,31.43
  Top 0.305: JP3.21 68.41,8.25 68.41,10.79 68.1,11.11 v68.1,27.86 68.1,31.43
RD5  (via drill 0.3)
  Top 0.254: U3.67 70.79,33.49 68.73,31.43
  Top 0.305: JP3.22 69.69,10.79 68.73,11.74 v68.73,31.11 68.73,31.43
RD6  (via drill 0.3)
  Top 0.254: U3.68 71.29,33.35 69.37,31.43
  Top 0.305: JP3.23 70.95,8.25 70.95,10.79 69.37,12.38 v69.37,27.86 69.37,31.43
RD7  (via drill 0.3)
  Top 0.254: U3.69 71.79,33.22 70,31.43
  Top 0.305: JP3.24 72.22,10.79 70,13.01 v70,31.11 70,31.43
RD8  (via drill 0.3)
  Top 0.254: U3.54 63.97,40.16 56.03,32.22
  Top 0.305: 56.03,32.22 v56.03,26.98 56.03,13.97 v57.3,12.7 | v53.49,26.98 LED2.C
  Bottom 0.305: JP3.33 83.66,8.25 83.66,11.43 82.39,12.7 v57.3,12.7 | v56.03,26.98 v53.49,26.98
RD9  (via drill 0.3)
  Top 0.254: U3.55 64.1,39.66 56.67,32.22
  Top 0.305: 56.67,32.22 v56.67,24.6 56.67,14.6 v57.3,13.97 | LED3.C v53.49,24.6
  Bottom 0.305: JP3.34 84.92,11.43 82.39,13.97 v57.3,13.97 | v56.67,24.6 v53.49,24.6
RD10  (via drill 0.3)
  Top 0.254: U3.56 64.24,39.16 57.3,32.22
  Top 0.305: v57.3,15.24 v57.3,22.86 57.3,32.22 | LED4.C 52.86,22.22 v53.49,22.86
  Bottom 0.305: JP3.35 86.19,8.25 86.19,11.43 82.39,15.24 v57.3,15.24 | v57.3,22.86 | v57.3,22.86 v53.49,22.86
RD11  (via drill 0.3)
  Top 0.254: U3.57 64.37,38.66 57.94,32.22
  Top 0.305: v57.94,16.5 v57.94,22.22 57.94,32.22 | LED5.C v53.49,21.11
  Bottom 0.305: JP3.36 87.47,11.43 83.97,14.92 83.97,15.87 83.34,16.5 v57.94,16.5 | v53.49,21.11 | v53.49,21.11 54.6,22.22 v57.94,22.22 | v57.94,22.22
RD12  (via drill 0.3)
  Top 0.254: U3.64 69.29,33.89 66.83,31.43
  Top 0.305: v66.83,17.77 66.83,31.43
  Bottom 0.305: JP3.37 88.73,8.25 88.73,11.43 84.61,15.55 84.61,16.19 83.02,17.77 v66.83,17.77
RD13  (via drill 0.3)
  Top 0.254: U3.65 69.79,33.76 67.46,31.43
  Top 0.305: v67.46,19.04 67.46,31.43
  Bottom 0.305: JP3.38 90,11.43 85.24,16.19 85.24,16.5 82.7,19.04 v67.46,19.04
RD14  (via drill 0.3)
  Top 0.254: v67.46,52.7 67.46,51.75 69.29,49.92 U3.37 | 91.28,8.25 91.28,16.5 90,17.77 v90,46.35 | JP6.5 96.36,22.22 96.36,17.14 95.72,16.5 94.77,16.5 93.81,15.55 93.81,8.25 JP3.39
  Top 0.305: JP3.39 91.28,8.25
  Bottom 0.305: v67.46,52.7 67.46,46.98 68.1,46.35 v90,46.35
RD15  (via drill 0.3)
  Top 0.254: JP3.40 92.55,16.5 91.28,17.77 91.28,23.49 | 91.28,23.49 v91.28,45.72 | 91.28,23.49 JP6.6 | v66.83,52.07 66.83,51.75 68.79,49.78 U3.38
  Bottom 0.305: v66.83,52.07 66.83,46.35 67.46,45.72 v91.28,45.72
RE0  (via drill 0.3)
  Top 0.254: v78.58,20.95 78.58,30.47 75.29,33.76 U3.76
  Bottom 0.305: JP3.1 45.55,8.25 45.55,10.79 55.71,20.95 v78.58,20.95
RE1  (via drill 0.3)
  Top 0.254: v79.21,21.58 79.21,30.47 75.79,33.89 U3.77
  Bottom 0.305: JP3.2 44.28,10.79 55.08,21.58 v79.21,21.58
RE2  (via drill 0.3)
  Top 0.254: U3.78 76.29,34.03 79.84,30.47
  Top 0.305: v79.84,19.68 79.84,30.47
  Bottom 0.305: JP3.3 48.09,8.25 48.09,10.79 56.98,19.68 v79.84,19.68
RE3  (via drill 0.3)
  Top 0.254: U3.79 76.79,34.16 80.48,30.47
  Top 0.305: v80.48,20.31 80.48,30.47
  Bottom 0.305: JP3.4 46.82,10.79 56.35,20.31 v80.48,20.31
RE4  (via drill 0.3)
  Top 0.254: 81.11,30.47 77.3,34.29 | 77.3,34.29 77.29,34.3 77.29,34.29 | 77.29,34.29 U3.80 | 77.3,34.29 77.29,34.29
  Top 0.305: v81.11,17.14 81.11,30.47
  Bottom 0.305: JP3.5 50.63,8.25 50.63,10.79 56.98,17.14 v81.11,17.14
RE5  (via drill 0.3)
  Top 0.254: U3.1 80.15,37.16 81.75,35.55
  Top 0.305: v81.75,18.41 81.75,35.55
  Bottom 0.305: JP3.6 49.37,10.79 56.98,18.41 v81.75,18.41
RE6  (via drill 0.3)
  Top 0.254: U3.2 80.28,37.66 82.39,35.55
  Top 0.305: v81.75,14.6 82.39,15.24 82.39,35.55
  Bottom 0.305: JP3.7 53.17,8.25 53.17,10.79 56.98,14.6 v81.75,14.6
RE7  (via drill 0.3)
  Top 0.254: U3.3 80.42,38.16 83.02,35.55
  Top 0.305: v83.02,15.87 83.02,35.55
  Bottom 0.305: JP3.8 51.91,10.79 56.98,15.87 v83.02,15.87
RE8  (via drill 0.3)
  Top 0.254: v80.48,12.06 80.48,13.33 81.11,13.97 82.39,13.97 83.66,15.24 83.66,37.46 86.19,40 86.19,43.81 85.88,44.13 82.07,44.13 81.09,43.16 U3.13
  Bottom 0.254: 55.71,8.25 55.71,10.79 56.98,12.06
  Bottom 0.305: JP3.9 55.71,8.25 | 56.98,12.06 v80.48,12.06
RE9  (via drill 0.3)
  Top 0.254: v81.75,13.33 82.7,13.33 84.29,14.92 84.29,36.83 86.83,39.37 86.83,43.97 86.19,44.6 81.91,44.6 80.96,43.66 U3.14
  Bottom 0.305: JP3.10 54.45,10.79 56.98,13.33 v81.75,13.33
RF0  (via drill 0.3)
  Top 0.254: X3.1 7,56.51 21.74,56.51 SPI.7 | U3.72 73.29,33.22 75.4,31.11
  Top 0.305: v75.4,29.84 75.4,31.11
  Bottom 0.254: 23.17,44.13 21.58,45.72 21.55,53.46 SPI.7
  Bottom 0.305: 23.17,44.13 29.68,44.13 32.85,40.95 39.52,40.95 47.46,40.95 48.41,40 48.41,31.59 50.16,29.84 v75.4,29.84
RF1  (via drill 0.3)
  Top 0.254: 21.11,77.34 X3.WRITE_PROT 26.43,77.38 R19.2 | 21.11,77.34 21.04,77.34 | v49.37,40.64 49.37,54.61 v47.46,56.51 | v76.19,30.47 76.19,30.95 73.79,33.35 U3.73 | SPI.8 26.98,56.03 26.98,63.17 19.84,70.31 19.84,76.04 21.11,77.31 21.11,77.34
  Bottom 0.254: v47.46,56.51 27.46,56.51 SPI.8
  Bottom 0.305: v76.19,30.47 50.63,30.47 49.37,31.74 v49.37,40.64
RF2  (via drill 0.3)
  Top 0.254: v64.29,65.4 v64.29,46.98 64.29,46.67 64.8,46.16 U3.42 | v89.37,43.81 v89.37,22.22
  Bottom 0.254: JP4.33 84.92,67.94 82.39,65.4 v64.29,65.4 | v89.37,22.22 96.36,22.22 JP6.3
  Bottom 0.305: v64.29,46.98 64.29,44.76 65.24,43.81 v89.37,43.81
RF3  (via drill 0.3)
  Top 0.254: v64.92,47.62 v64.92,66.67 | v90.64,44.45 v90.64,20.95 | U3.41 65.25,46.66 64.92,46.98
  Top 0.305: v64.92,47.62 64.92,46.98
  Bottom 0.254: JP4.34 83.66,72.38 83.66,67.94 82.39,66.67 v64.92,66.67 | v90.64,20.95 JP6.4
  Bottom 0.305: v64.92,47.62 64.92,45.08 65.56,44.45 v90.64,44.45
RF4  (via drill 0.3)
  Top 0.254: v66.19,57.78 66.19,51.75 68.29,49.65 U3.39 | JP6.11 96.99,31.11 95.72,32.38 94.45,32.38 93.81,33.02 93.81,69.84 JP4.39
  Bottom 0.254: JP4.39 92.55,67.94 82.39,57.78 v66.19,57.78
RF5  (via drill 0.3)
  Top 0.254: v65.56,58.41 65.56,51.75 67.79,49.51 U3.40 | JP6.12 94.45,31.11 93.18,32.38 93.18,68.57 91.28,70.48 91.28,72.38 JP4.40
  Bottom 0.254: JP4.40 91.28,72.38 91.28,67.94 81.75,58.41 v65.56,58.41
RF6  (via drill 0.3)
  Top 0.254: v62.38,57.15 62.38,46.03 63.76,44.66 U3.45 | X3.5 7.58,66.67 16.66,66.67 v19.2,64.13
  Bottom 0.254: v62.38,57.15 62.19,57.27 27.33,57.27 26.19,56.19 22.86,56.19 21.74,57.3 21.74,58.57 SPI.3 v19.2,64.13
RF7  (via drill 0.3)
  Top 0.254: v63.02,58.41 63.02,46.35 64.21,45.16 U3.44 | SPI.5 21.74,59.05 21.74,66.67 16.66,71.75 6.3,71.75 X3.7
  Bottom 0.254: v63.02,58.41 26.82,58.41 26.5,58.73 24.6,58.73 SPI.5
RF8  (via drill 0.3)
  Top 0.254: v63.65,57.78 63.65,46.51 64.51,45.66 U3.43 | X3.2 7.58,58.8 20.24,58.8 22.95,56.13 24.55,56.13 26,57.53 SPI.6
  Bottom 0.254: v63.65,57.78 26.19,57.78 SPI.6
RG0  (via drill 0.3)
  Top 0.254: JP4.37 90,70.16 92.55,67.62 v92.55,30.47 93.18,29.84 96.36,29.84 JP6.9 | U3.75 74.79,33.62 77.94,30.47
  Top 0.305: v77.94,29.2 77.94,30.47
  Bottom 0.305: v77.94,29.2 91.28,29.2 v92.55,30.47
RG1  (via drill 0.3)
  Top 0.254: JP4.38 88.73,72.38 88.73,69.84 91.91,66.67 v91.91,31.11 91.91,29.2 92.55,28.57 JP6.10 | U3.74 74.29,33.49 77.3,30.47
  Top 0.305: v77.3,29.84 77.3,30.47
  Bottom 0.305: v77.3,29.84 90.64,29.84 v91.91,31.11
RG2  (via drill 0.3)
  Top 0.254: v61.11,62.86 61.11,45.4 v62.38,44.13 62.85,43.66 U3.47
  Bottom 0.254: JP4.35 87.47,67.94 84.92,65.4 84.92,64.13 83.66,62.86 v61.11,62.86 | JP6.7 96.36,27.3 94.45,27.3 93.18,28.57 93.18,36.19 87.47,41.91
  Bottom 0.305: v62.38,44.13 64.61,41.91 87.47,41.91
RG3  (via drill 0.3)
  Top 0.254: v61.75,64.13 61.75,45.72 v62.38,45.08 63.31,44.16 U3.46 | v88.73,43.18 v88.73,26.03
  Bottom 0.254: JP4.36 86.19,72.38 86.19,67.94 84.29,66.03 84.29,64.45 83.97,64.13 v61.75,64.13 | v88.73,26.03 JP6.8 | 64.29,43.18 64.22,43.3 64.22,44.06 63.21,44.06 63.21,44.83 62.45,44.83 v62.38,45.08
  Bottom 0.305: 64.29,43.18 v88.73,43.18
RG6  (via drill 0.3)
  Top 0.254: U3.6 81.14,39.66 v81.43,39.37 | U1.8 34.24,46.63 v34.28,46.67
  Bottom 0.305: v81.43,39.37 63.34,39.37 56.03,46.67 v34.28,46.67
RG7  (via drill 0.3)
  Top 0.254: U3.7 81.75,40.16 v82.07,39.84 | U1.6 v35.54,47.29 v35.55,47.3
  Bottom 0.305: v82.07,39.84 81.91,40 63.65,40 56.35,47.3 v35.55,47.3
RG8  (via drill 0.3)
  Top 0.254: U3.8 82.36,40.66 v82.54,40.48 | U1.7 34.89,47.91 v34.92,47.94
  Bottom 0.305: v82.54,40.48 82.39,40.64 63.97,40.64 56.67,47.94 v34.92,47.94 | v82.54,40.48
RG9  (via drill 0.3)
  Top 0.254: U3.10 83.27,41.66 v83.66,41.27 | U1.9 33.59,48.52 v33.65,48.57
  Bottom 0.305: v83.66,41.27 64.29,41.27 56.98,48.57 v33.65,48.57
RTC_IN
  Top 0.254: C20.2 | U3.59 64.72,37.66 60.48,33.41
  Top 0.305: 60.48,33.41 Q2.1 60.48,30.16 C20.2
RTC_OUT
  Top 0.254: C19.2 | U3.60 64.94,37.16 63.02,35.24
  Top 0.305: 63.02,35.24 Q2.2 63.02,30.16 C19.2
RX+
  Top 0.254: U1.13 30.99,44.17 27.14,40.32 23.33,40.32 R9.2 21.74,38.73 X1.P$4
RX-
  Top 0.254: U1.12 31.64,43.87 27.14,39.37 R10.1 25.55,38.73 24.6,37.78 16.03,37.78 15.39,38.41 15.39,39.68 X1.P$5
TCL
  Top 0.305: X1.P$1 17.93,34.13 20.15,34.13 20.95,33.33 R7.1 | R7.1 | R8.2 R7.1 | R8.2 | 27.93,33.33 L2.1 | 27.93,33.33 27.93,33.38 | 27.93,33.33 L2.1 | L2.1 | R8.2 27.93,33.33 | C24.1 | L2.1 | L2.1 C24.1
TPIN
  Top 0.254: R9.1 R10.2 25.55,44.76 C25.1
TX+
  Top 0.254: R7.2 23.64,34.29 26.66,34.29 27.14,34.76 | U1.17 31.64,36.57 29.84,34.76
  Top 0.305: X1.P$2 | X1.P$2 16.82,34.76 17.3,35.24 R7.2 | R7.2 | 27.14,34.76 29.84,34.76
TX-
  Top 0.254: U1.16 30.99,36.87 29.68,35.55
  Top 0.305: X1.P$3 24.28,36.83 25.39,35.71 R8.1 | R8.1 | R8.1 | R8.1 | 29.68,35.55 25.71,35.55 R8.1
V1
  Top 0.61: 58.25,5.71 41.74,5.71 41.74,9.52 JP1.2 | 58.25,5.71 78.58,5.71 | 78.58,5.71 96.36,5.71 96.36,9.52 | 97.94,9.52 JP3.44 96.36,9.52 | 96.36,9.52 JP3.42 | 58.57,9.52 58.25,9.52 58.25,5.71 | 58.57,9.52 JP3.14 | 58.57,9.52 JP3.12 | JP3.28 JP3.30 78.58,9.52 78.58,5.71
V2  (via drill 0.6)
  Top 0.61: JP2.2 41.43,73.66 v41.43,74.92
  Bottom 0.61: v41.43,74.92 56.98,74.92 | 56.98,74.92 JP4.12 | 59.52,74.92 JP4.14 | 56.98,74.92 59.52,74.92 | 77.3,74.92 JP4.28 | 59.52,74.92 77.3,74.92 | 79.84,74.92 JP4.30 | 77.3,74.92 79.84,74.92 | 79.84,74.92 95.08,74.92 JP4.42 JP4.44
VCAB
  Top 0.254: U1.1 38.79,47.21 39.84,48.26 C26.2
VDDCORE
  Top 0.254: C29.1 71.27,31.74 72.29,32.77 U3.70

### Text on the board
Top: ESCHER v1.0
tPlace: AD | + | + | AD | + | + | GP | + | + | - | - | - | - | - | 1 | - | - | - | 1 | - | - | 1 | 1 | MCRL | - | 3v3 | 8 | - | 5v0 | 5v0 | - | UART | CAN | I2C | UART | 3v3 | - | PWM | + | + | - | OC | + | + | - | IC | + | + | - | - | - | - | - | - | - | - | 1 | 1 | 1
tNames: Algorythmics 2008 | ESCHER v1.0 | http://algo.mur.at/ | CC-BY-SA 2.5
tTest: 5V | 3V3 | 9V | 5V | 5V | 3V3